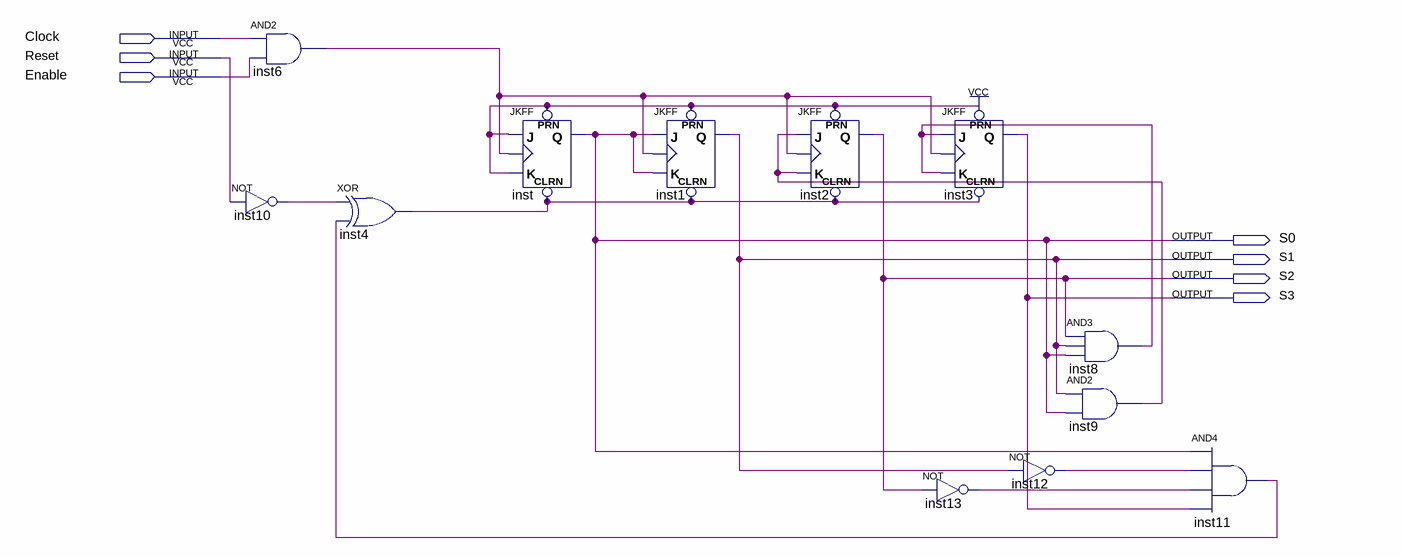
[diagram p0: schematic sheet]
// Quartus schematic Cont_sinc_0_8.bdf as structural Verilog: 12 symbols, 7 pins
module Cont_sinc_0_8 (
  input  Clock,
  input  Reset,
  input  Enable,
  output S0,
  output S1,
  output S2,
  output S3
);

  wire inst4_out, inst6_out, inst8_out, inst9_out, inst10_out, inst11_out, inst12_out, inst13_out;

  and inst6 (inst6_out, Clock, Enable);
  not inst10 (inst10_out, Reset);
  xor inst4 (inst4_out, inst10_out, inst11_out);
  JKFF inst (.PRN(1'b1), .CLRN(inst4_out), .K(1'b1), .J(1'b1), .CLK(inst6_out), .Q(S0));
  JKFF inst1 (.PRN(1'b1), .CLRN(inst4_out), .K(S0), .J(S0), .CLK(inst6_out), .Q(S1));
  JKFF inst2 (.PRN(1'b1), .CLRN(inst4_out), .K(inst9_out), .J(inst9_out), .CLK(inst6_out), .Q(S2));
  JKFF inst3 (.PRN(1'b1), .CLRN(inst4_out), .K(inst8_out), .J(inst8_out), .CLK(inst6_out), .Q(S3));
  not inst13 (inst13_out, S2);
  not inst12 (inst12_out, S1);
  and inst8 (inst8_out, S2, S1, S0);
  and inst9 (inst9_out, S1, S0);
  and inst11 (inst11_out, S0, inst12_out, inst13_out, S3);
endmodule
